# Altium schematic sheet Sheet1.SchDoc
size A4
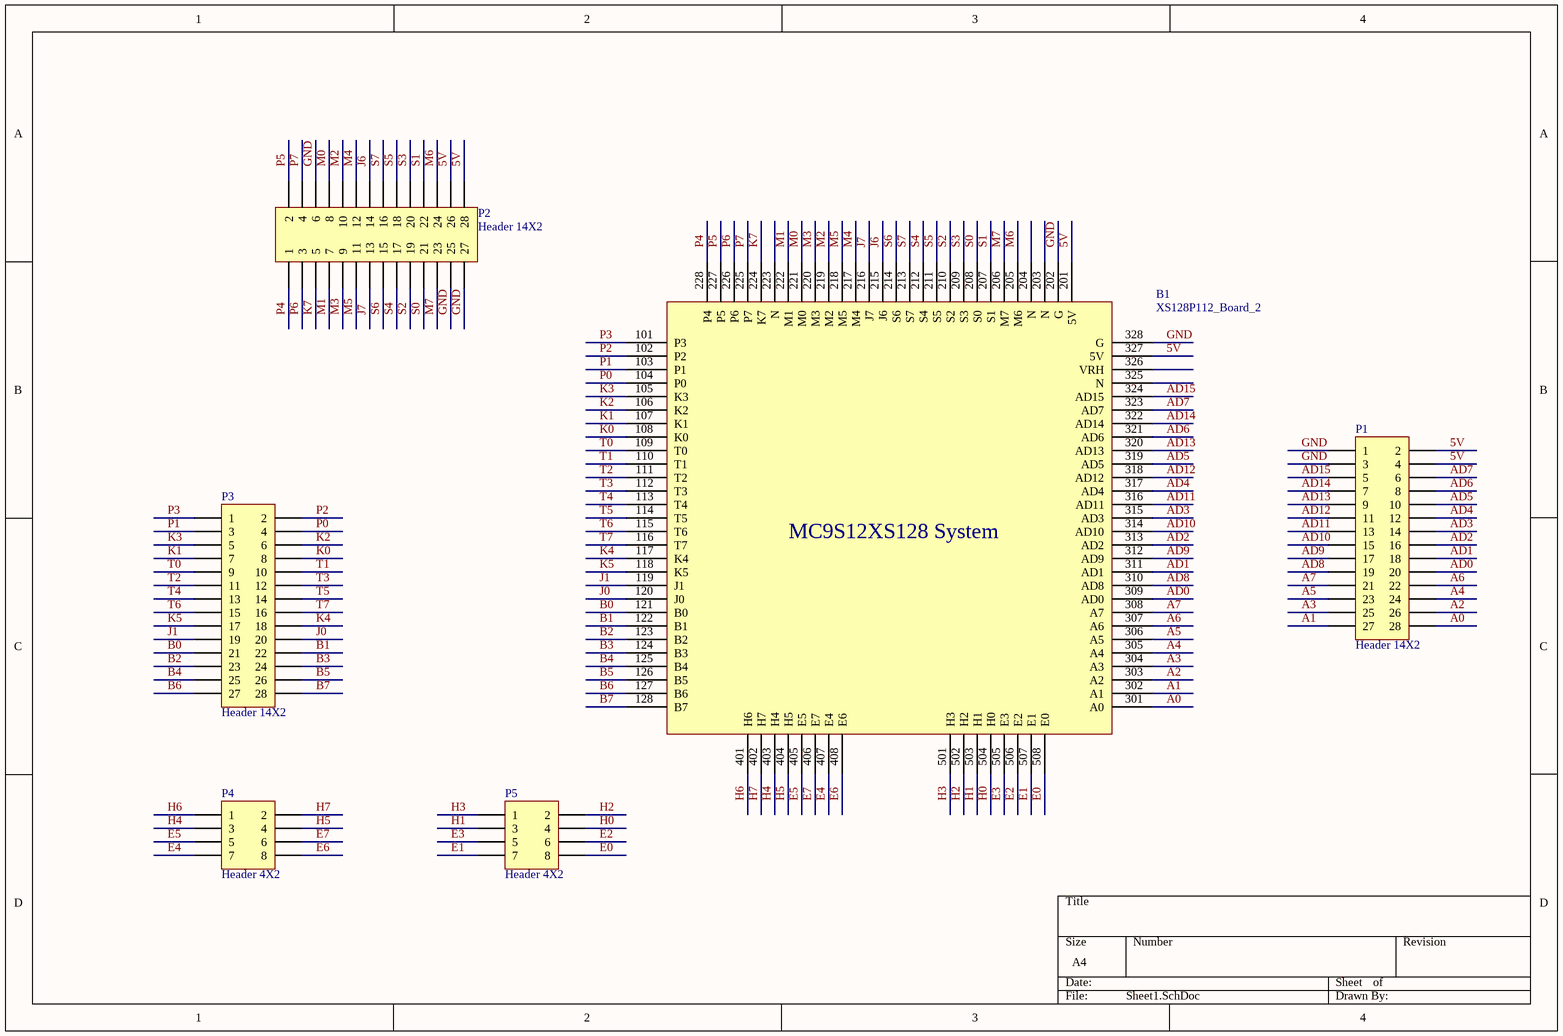
[diagram p0: Sheet1.SchDoc]

## Parts
B1  XS128P112_Board_2  [XS128P112_BOARD]
P1  Header 14X2  [HDR2X14]
P2  Header 14X2  [HDR2X14]
P3  Header 14X2  [HDR2X14]
P4  Header 4X2  [HDR2X4]
P5  Header 4X2  [HDR2X4]

## Nets
5V: B1.201(5V) B1.327(5V) P1.2 P1.4 P2.26 P2.28
A0: B1.301(A0) P1.28
A1: B1.302(A1) P1.27
A2: B1.303(A2) P1.26
A3: B1.304(A3) P1.25
A4: B1.305(A4) P1.24
A5: B1.306(A5) P1.23
A6: B1.307(A6) P1.22
A7: B1.308(A7) P1.21
AD0: B1.309(AD0) P1.20
AD1: B1.311(AD1) P1.18
AD2: B1.313(AD2) P1.16
AD3: B1.315(AD3) P1.14
AD4: B1.317(AD4) P1.12
AD5: B1.319(AD5) P1.10
AD6: B1.321(AD6) P1.8
AD7: B1.323(AD7) P1.6
AD8: B1.310(AD8) P1.19
AD9: B1.312(AD9) P1.17
AD10: B1.314(AD10) P1.15
AD11: B1.316(AD11) P1.13
AD12: B1.318(AD12) P1.11
AD13: B1.320(AD13) P1.9
AD14: B1.322(AD14) P1.7
AD15: B1.324(AD15) P1.5
B0: B1.121(B0) P3.21
B1: B1.122(B1) P3.22
B2: B1.123(B2) P3.23
B3: B1.124(B3) P3.24
B4: B1.125(B4) P3.25
B5: B1.126(B5) P3.26
B6: B1.127(B6) P3.27
B7: B1.128(B7) P3.28
E0: B1.508(E0) P5.8
E1: B1.507(E1) P5.7
E2: B1.506(E2) P5.6
E3: B1.505(E3) P5.5
E4: B1.407(E4) P4.7
E5: B1.405(E5) P4.5
E6: B1.408(E6) P4.8
E7: B1.406(E7) P4.6
GND: B1.202(G) B1.328(G) P1.1 P1.3 P2.6 P2.25 P2.27
H0: B1.504(H0) P5.4
H1: B1.503(H1) P5.3
H2: B1.502(H2) P5.2
H3: B1.501(H3) P5.1
H4: B1.403(H4) P4.3
H5: B1.404(H5) P4.4
H6: B1.401(H6) P4.1
H7: B1.402(H7) P4.2
J0: B1.120(J0) P3.20
J1: B1.119(J1) P3.19
J6: B1.215(J6) P2.14
J7: B1.216(J7) P2.13
K0: B1.108(K0) P3.8
K1: B1.107(K1) P3.7
K2: B1.106(K2) P3.6
K3: B1.105(K3) P3.5
K4: B1.117(K4) P3.18
K5: B1.118(K5) P3.17
K7: B1.224(K7) P2.5
M0: B1.221(M0) P2.8
M1: B1.222(M1) P2.7
M2: B1.219(M2) P2.10
M3: B1.220(M3) P2.9
M4: B1.217(M4) P2.12
M5: B1.218(M5) P2.11
M6: B1.205(M6) P2.24
M7: B1.206(M7) P2.23
P0: B1.104(P0) P3.4
P1: B1.103(P1) P3.3
P2: B1.102(P2) P3.2
P3: B1.101(P3) P3.1
P4: B1.228(P4) P2.1
P5: B1.227(P5) P2.2
P6: B1.226(P6) P2.3
P7: B1.225(P7) P2.4
S0: B1.208(S0) P2.21
S1: B1.207(S1) P2.22
S2: B1.210(S2) P2.19
S3: B1.209(S3) P2.20
S4: B1.212(S4) P2.17
S5: B1.211(S5) P2.18
S6: B1.214(S6) P2.15
S7: B1.213(S7) P2.16
T0: B1.109(T0) P3.9
T1: B1.110(T1) P3.10
T2: B1.111(T2) P3.11
T3: B1.112(T3) P3.12
T4: B1.113(T4) P3.13
T5: B1.114(T5) P3.14
T6: B1.115(T6) P3.15
T7: B1.116(T7) P3.16

Not connected (* = marked no-connect by the designer): B1 203(N) 204(N) 223(N) 325(N) 326(VRH)

## Notes on the sheet
- (in symbol XS128P112_Board_2) MC9S12XS128 System

## Library data of the parts
P1-P3 = Header 14X2: Header, 14-Pin, Dual row; LatestRevisionDate: 17-Jul-2002; LatestRevisionNote: Re-released for DXP Platform.; Publisher: Altium Limited
P4 P5 = Header 4X2: Header, 4-Pin, Dual row; LatestRevisionDate: 17-Jul-2002; LatestRevisionNote: Re-released for DXP Platform.; Publisher: Altium Limited